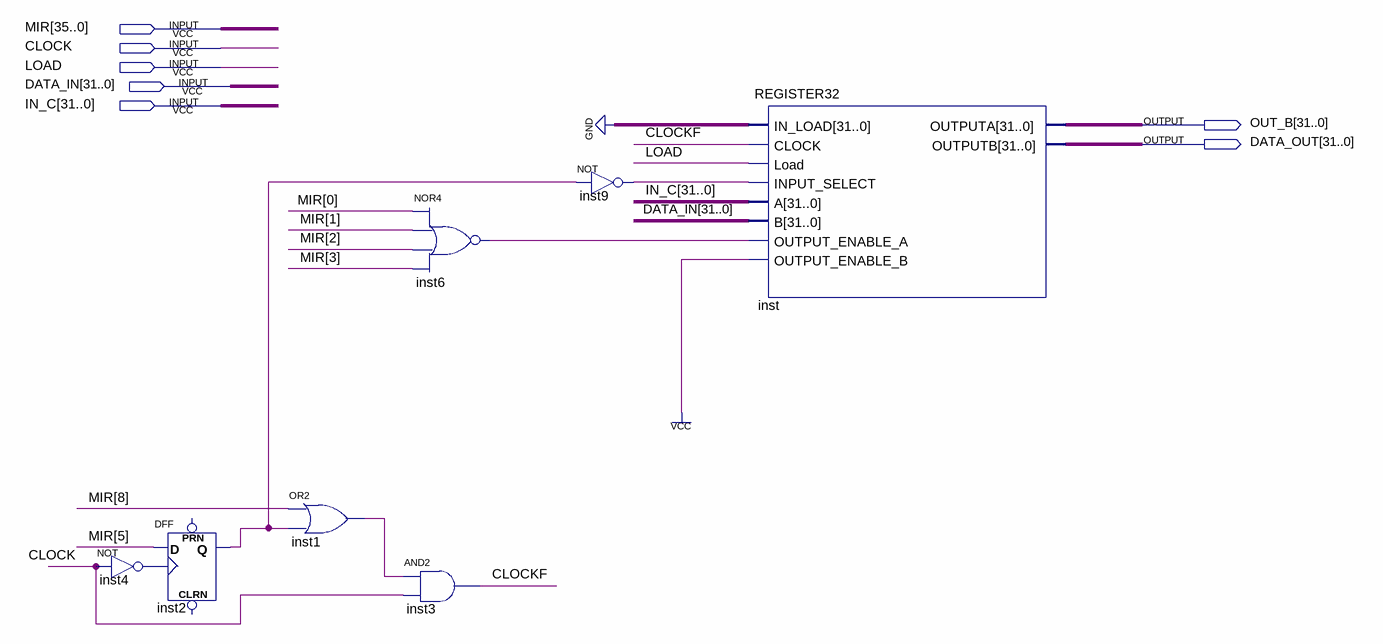
[diagram p0: schematic sheet]
// Quartus schematic MDR.bdf as structural Verilog: 7 symbols, 7 pins
module MDR (
  input  [35:0] MIR,
  input  CLOCK,
  input  LOAD,
  input  [31:0] DATA_IN,
  input  [31:0] IN_C,
  output [31:0] OUT_B,
  output [31:0] DATA_OUT
);

  wire CLOCKF, inst1_out, inst2_q, inst4_out, inst6_out, inst9_out;

  not inst4 (inst4_out, CLOCK);
  DFF inst2 (.CLK(inst4_out), .D(MIR[5]), .Q(inst2_q));  // open: CLRN, PRN
  or inst1 (inst1_out, MIR[8], inst2_q);
  nor inst6 (inst6_out, MIR[0], MIR[1], MIR[2], MIR[3]);
  and inst3 (CLOCKF, inst1_out, CLOCK);
  not inst9 (inst9_out, inst2_q);
  REGISTER32 inst (
    .IN_LOAD({32{1'b0}}), .CLOCK(CLOCKF), .Load(LOAD), .INPUT_SELECT(inst9_out), .A(IN_C), .B(DATA_IN),
    .OUTPUT_ENABLE_A(inst6_out), .OUTPUT_ENABLE_B(1'b1), .OUTPUTA(OUT_B), .OUTPUTB(DATA_OUT));
endmodule
